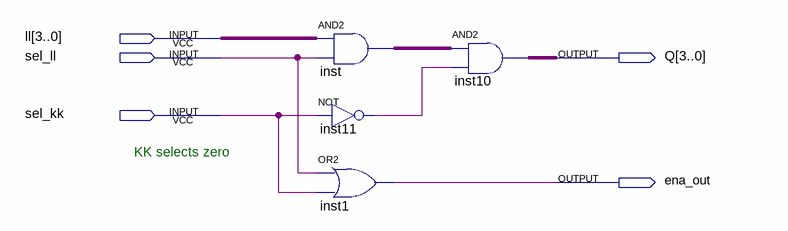
[diagram p0: schematic sheet]
// Quartus schematic alu_op1_mux_high.bdf as structural Verilog: 4 symbols, 5 pins
module alu_op1_mux_high (
  input  [3:0] ll,
  input  sel_ll,
  input  sel_kk,
  output [3:0] Q,
  output ena_out
);

  wire inst11_out;
  wire [3:0] inst_out;

  assign inst_out = ll & {4{sel_ll}};  // AND2 inst, 4 bits wide
  not inst11 (inst11_out, sel_kk);
  or inst1 (ena_out, sel_ll, sel_kk);
  assign Q = inst_out & {4{inst11_out}};  // AND2 inst10, 4 bits wide

  // Notes on the sheet:
  //   KK selects zero
endmodule
